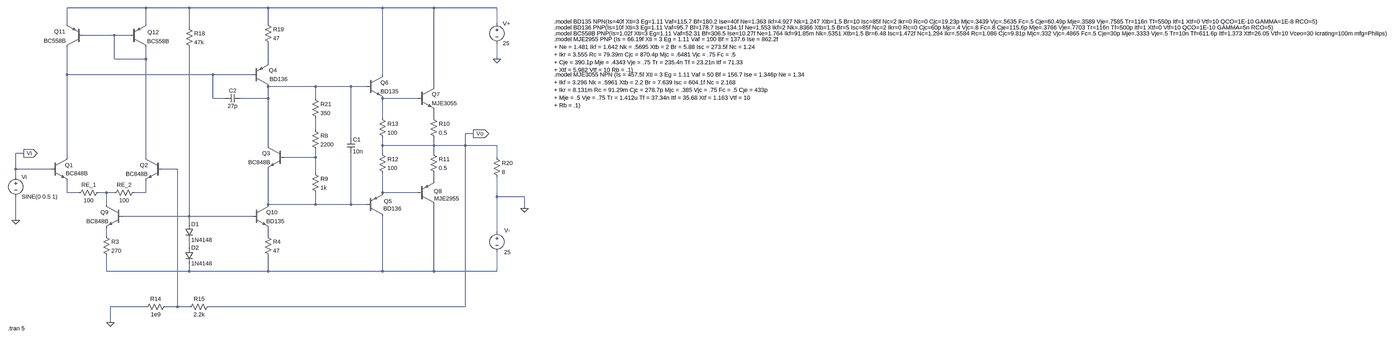
[diagram p0: schematic Ejercicio_6_ganancia_unitaria.asc, whole sheet]
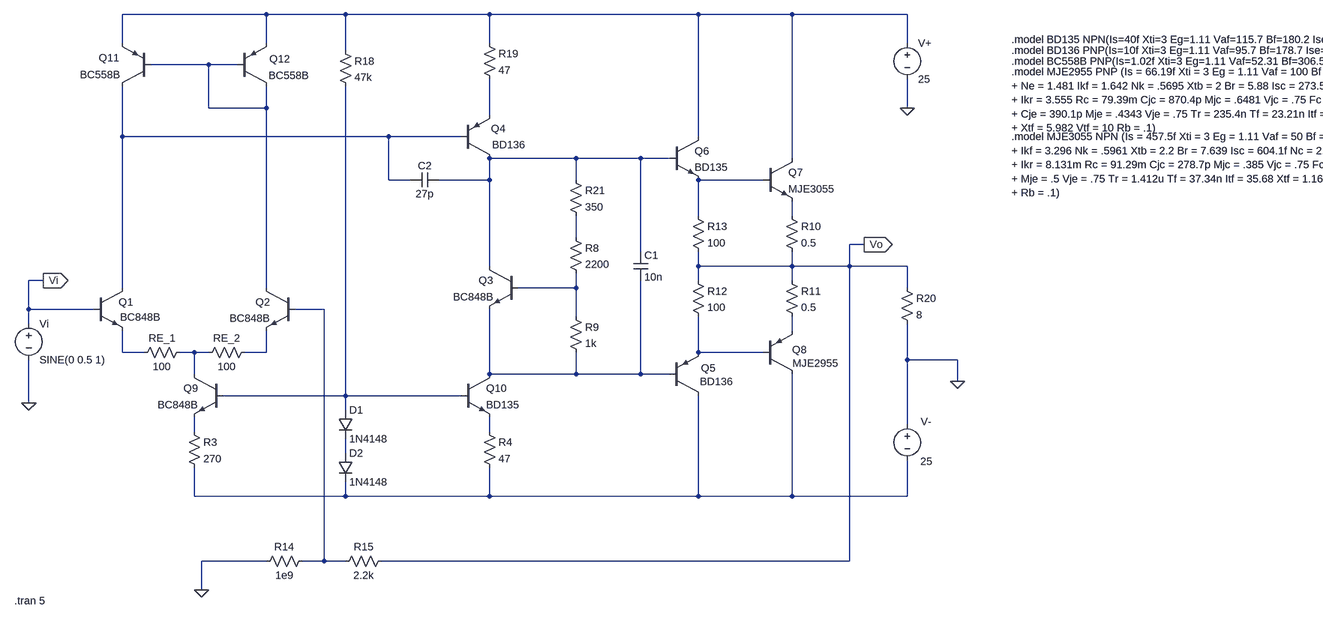
[diagram p1: schematic Ejercicio_6_ganancia_unitaria.asc, part, row 1 of 1, column 1 of 2]
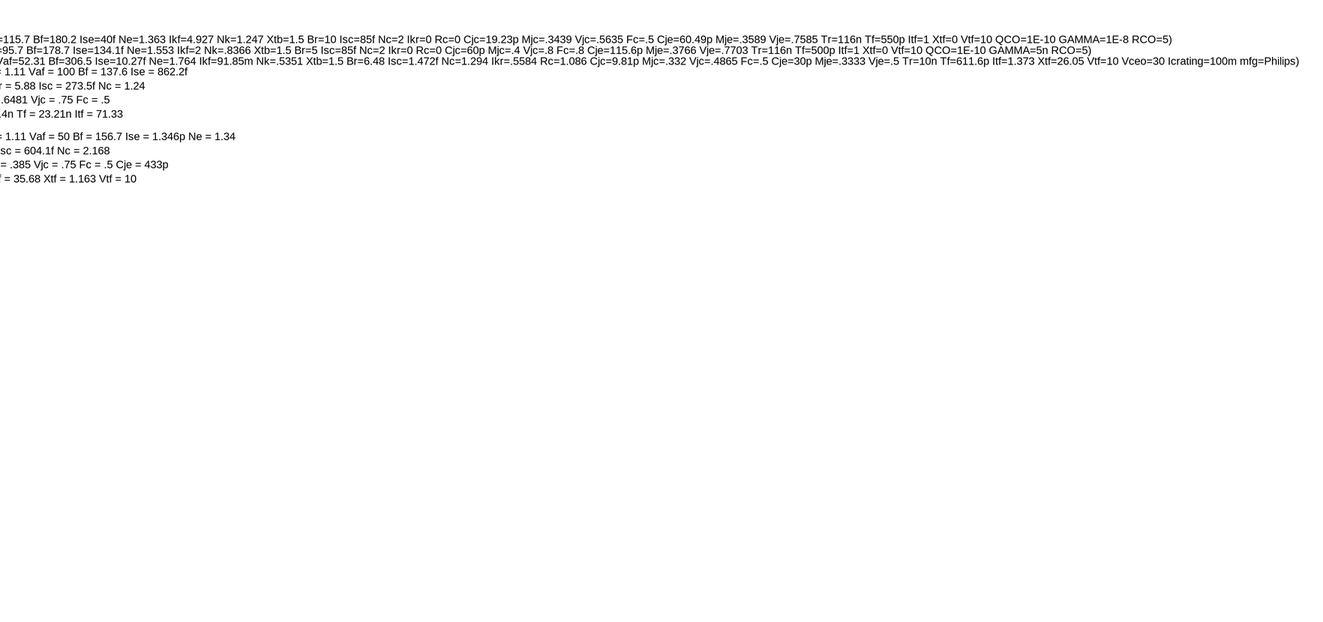
[diagram p2: schematic Ejercicio_6_ganancia_unitaria.asc, part, row 1 of 1, column 2 of 2]
Ejercicio_6_ganancia_unitaria.asc, the LTspice schematic file:
Version 4
SHEET 1 4952 680
WIRE -608 -848 -928 -848
WIRE -432 -848 -608 -848
WIRE -112 -848 -432 -848
WIRE 352 -848 -112 -848
WIRE 560 -848 352 -848
WIRE 816 -848 560 -848
WIRE -928 -784 -928 -848
WIRE -608 -784 -608 -848
WIRE -112 -784 -112 -848
WIRE 816 -784 816 -848
WIRE -432 -768 -432 -848
WIRE -736 -736 -864 -736
WIRE -672 -736 -736 -736
WIRE -736 -640 -736 -736
WIRE -608 -640 -608 -688
WIRE -608 -640 -736 -640
WIRE 816 -640 816 -704
WIRE -112 -624 -112 -704
WIRE -928 -576 -928 -688
WIRE -336 -576 -928 -576
WIRE -176 -576 -336 -576
WIRE 352 -576 352 -848
WIRE 80 -528 -112 -528
WIRE 224 -528 80 -528
WIRE 288 -528 224 -528
WIRE 560 -528 560 -848
WIRE -336 -480 -336 -576
WIRE -288 -480 -336 -480
WIRE -112 -480 -112 -528
WIRE -112 -480 -224 -480
WIRE 80 -480 80 -528
WIRE 496 -480 352 -480
WIRE 352 -400 352 -480
WIRE 560 -400 560 -432
WIRE 80 -352 80 -400
WIRE 720 -336 688 -336
WIRE 224 -320 224 -528
WIRE -112 -288 -112 -480
WIRE 352 -288 352 -320
WIRE 560 -288 560 -320
WIRE 560 -288 352 -288
WIRE 688 -288 688 -336
WIRE 688 -288 560 -288
WIRE 816 -288 688 -288
WIRE -1104 -256 -1136 -256
WIRE 352 -256 352 -288
WIRE 560 -256 560 -288
WIRE -928 -240 -928 -576
WIRE -608 -240 -608 -640
WIRE 80 -240 80 -272
WIRE 80 -240 -48 -240
WIRE 816 -240 816 -288
WIRE -1136 -192 -1136 -256
WIRE -992 -192 -1136 -192
WIRE -480 -192 -544 -192
WIRE 80 -176 80 -240
WIRE -1136 -160 -1136 -192
WIRE 560 -144 560 -176
WIRE -928 -96 -928 -144
WIRE -880 -96 -928 -96
WIRE -768 -96 -800 -96
WIRE -736 -96 -768 -96
WIRE -608 -96 -608 -144
WIRE -608 -96 -656 -96
WIRE 352 -96 352 -176
WIRE 496 -96 352 -96
WIRE 816 -80 816 -160
WIRE 928 -80 816 -80
WIRE -768 -48 -768 -96
WIRE -112 -48 -112 -192
WIRE 80 -48 80 -96
WIRE 80 -48 -112 -48
WIRE 224 -48 224 -256
WIRE 224 -48 80 -48
WIRE 288 -48 224 -48
WIRE 928 -32 928 -80
WIRE -432 0 -432 -688
WIRE -432 0 -704 0
WIRE -176 0 -432 0
WIRE -1136 16 -1136 -80
WIRE -432 32 -432 0
WIRE 816 64 816 -80
WIRE -768 80 -768 48
WIRE -112 80 -112 48
WIRE -432 128 -432 96
WIRE -768 224 -768 160
WIRE -432 224 -432 192
WIRE -432 224 -768 224
WIRE -112 224 -112 160
WIRE -112 224 -432 224
WIRE 352 224 352 0
WIRE 352 224 -112 224
WIRE 560 224 560 -48
WIRE 560 224 352 224
WIRE 816 224 816 144
WIRE 816 224 560 224
WIRE -608 368 -752 368
WIRE -480 368 -480 -192
WIRE -480 368 -528 368
WIRE -432 368 -480 368
WIRE 688 368 688 -288
WIRE 688 368 -352 368
WIRE -752 432 -752 368
FLAG 816 -640 0
FLAG 928 -32 0
FLAG -752 432 0
FLAG -1136 16 0
FLAG 720 -336 Vo
IOPIN 720 -336 Out
FLAG -1104 -256 Vi
IOPIN -1104 -256 Out
SYMBOL pnp -864 -688 R180
WINDOW 0 71 63 Left 2
WINDOW 3 69 26 Left 2
SYMATTR InstName Q11
SYMATTR Value BC558B
SYMBOL pnp -672 -688 M180
WINDOW 0 71 61 Left 2
WINDOW 3 69 24 Left 2
SYMATTR InstName Q12
SYMATTR Value BC558B
SYMBOL npn -992 -240 R0
WINDOW 3 59 65 Left 2
SYMATTR Value BC848B
SYMATTR InstName Q1
SYMBOL npn -544 -240 M0
SYMATTR InstName Q2
SYMATTR Value BC848B
SYMBOL npn -704 -48 M0
SYMATTR InstName Q9
SYMATTR Value BC848B
SYMBOL npn -176 -48 R0
SYMATTR InstName Q10
SYMATTR Value BD135
SYMBOL npn 288 -576 R0
SYMATTR InstName Q6
SYMATTR Value BD135
SYMBOL npn 496 -528 R0
SYMATTR InstName Q7
SYMATTR Value MJE3055
SYMBOL npn -48 -288 M0
SYMATTR InstName Q3
SYMATTR Value BC848B
SYMBOL pnp 496 -48 M180
WINDOW 0 64 54 Left 2
WINDOW 3 65 24 Left 2
SYMATTR InstName Q8
SYMATTR Value MJE2955
SYMBOL pnp 288 0 M180
WINDOW 0 70 61 Left 2
WINDOW 3 67 31 Left 2
SYMATTR InstName Q5
SYMATTR Value BD136
SYMBOL pnp -176 -528 M180
WINDOW 0 67 66 Left 2
WINDOW 3 70 30 Left 2
SYMATTR InstName Q4
SYMATTR Value BD136
SYMBOL voltage 816 -800 R0
WINDOW 123 0 0 Left 0
WINDOW 39 0 0 Left 0
SYMATTR InstName V+
SYMATTR Value 25
SYMBOL voltage 816 48 R0
WINDOW 0 30 10 Left 2
WINDOW 3 29 98 Left 2
WINDOW 123 0 0 Left 0
WINDOW 39 0 0 Left 0
SYMATTR InstName V-
SYMATTR Value 25
SYMBOL res -128 64 R0
SYMATTR InstName R4
SYMATTR Value 47
SYMBOL res -784 64 R0
SYMATTR InstName R3
SYMATTR Value 270
SYMBOL res 64 -496 R0
SYMATTR InstName R21
SYMATTR Value 350
SYMBOL res 64 -368 R0
SYMATTR InstName R8
SYMATTR Value 2200
SYMBOL res 64 -192 R0
SYMATTR InstName R9
SYMATTR Value 1k
SYMBOL res 336 -416 R0
SYMATTR InstName R13
SYMATTR Value 100
SYMBOL res 544 -416 R0
SYMATTR InstName R10
SYMATTR Value 0.5
SYMBOL res 544 -272 R0
SYMATTR InstName R11
SYMATTR Value 0.5
SYMBOL res 336 -272 R0
SYMATTR InstName R12
SYMATTR Value 100
SYMBOL res 800 -256 R0
SYMATTR InstName R20
SYMATTR Value 8
SYMBOL res -128 -800 R0
SYMATTR InstName R19
SYMATTR Value 47
SYMBOL res -784 -112 R90
WINDOW 0 0 56 VBottom 2
WINDOW 3 32 56 VTop 2
SYMATTR InstName RE_1
SYMATTR Value 100
SYMBOL res -640 -112 R90
WINDOW 0 0 56 VBottom 2
WINDOW 3 32 56 VTop 2
SYMATTR InstName RE_2
SYMATTR Value 100
SYMBOL cap 208 -320 R0
SYMATTR InstName C1
SYMATTR Value 10n
SYMBOL cap -224 -496 R90
WINDOW 0 0 32 VBottom 2
WINDOW 3 32 32 VTop 2
SYMATTR InstName C2
SYMATTR Value 27p
SYMBOL res -448 -784 R0
SYMATTR InstName R18
SYMATTR Value 47k
SYMBOL diode -448 32 R0
SYMATTR InstName D1
SYMATTR Value 1N4148
SYMBOL diode -448 128 R0
SYMATTR InstName D2
SYMATTR Value 1N4148
SYMBOL res -512 352 R90
WINDOW 0 0 56 VBottom 2
WINDOW 3 32 56 VTop 2
SYMATTR InstName R14
SYMATTR Value 1e9
SYMBOL res -336 352 R90
WINDOW 0 0 56 VBottom 2
WINDOW 3 32 56 VTop 2
SYMATTR InstName R15
SYMATTR Value 2.2k
SYMBOL voltage -1136 -176 R0
WINDOW 123 0 0 Left 0
WINDOW 39 0 0 Left 0
SYMATTR InstName Vi
SYMATTR Value SINE(0 0.5 1)
TEXT 1176 -744 Left 2 !.model BC558B PNP(Is=1.02f Xti=3 Eg=1.11 Vaf=52.31 Bf=306.5 Ise=10.27f Ne=1.764 Ikf=91.85m Nk=.5351 Xtb=1.5 Br=6.48 Isc=1.472f Nc=1.294 Ikr=.5584 Rc=1.086 Cjc=9.81p Mjc=.332 Vjc=.4865 Fc=.5 Cje=30p Mje=.3333 Vje=.5 Tr=10n Tf=611.6p Itf=1.373 Xtf=26.05 Vtf=10 Vceo=30 Icrating=100m mfg=Philips)
TEXT 1176 -720 Left 2 !.model MJE2955 PNP (Is = 66.19f Xti = 3 Eg = 1.11 Vaf = 100 Bf = 137.6 Ise = 862.2f\n+ Ne = 1.481 Ikf = 1.642 Nk = .5695 Xtb = 2 Br = 5.88 Isc = 273.5f Nc = 1.24\n+ Ikr = 3.555 Rc = 79.39m Cjc = 870.4p Mjc = .6481 Vjc = .75 Fc = .5\n+ Cje = 390.1p Mje = .4343 Vje = .75 Tr = 235.4n Tf = 23.21n Itf = 71.33\n+ Xtf = 5.982 Vtf = 10 Rb = .1)
TEXT 1176 -576 Left 2 !.model MJE3055 NPN (Is = 457.5f Xti = 3 Eg = 1.11 Vaf = 50 Bf = 156.7 Ise = 1.346p Ne = 1.34\n+ Ikf = 3.296 Nk = .5961 Xtb = 2.2 Br = 7.639 Isc = 604.1f Nc = 2.168\n+ Ikr = 8.131m Rc = 91.29m Cjc = 278.7p Mjc = .385 Vjc = .75 Fc = .5 Cje = 433p\n+ Mje = .5 Vje = .75 Tr = 1.412u Tf = 37.34n Itf = 35.68 Xtf = 1.163 Vtf = 10\n+ Rb = .1)
TEXT -1168 456 Left 2 !.tran 5
TEXT 1176 -792 Left 2 !.model BD135 NPN(Is=40f Xti=3 Eg=1.11 Vaf=115.7 Bf=180.2 Ise=40f Ne=1.363 Ikf=4.927 Nk=1.247 Xtb=1.5 Br=10 Isc=85f Nc=2 Ikr=0 Rc=0 Cjc=19.23p Mjc=.3439 Vjc=.5635 Fc=.5 Cje=60.49p Mje=.3589 Vje=.7585 Tr=116n Tf=550p Itf=1 Xtf=0 Vtf=10 QCO=1E-10 GAMMA=1E-8 RCO=5)
TEXT 1176 -768 Left 2 !.model BD136 PNP(Is=10f Xti=3 Eg=1.11 Vaf=95.7 Bf=178.7 Ise=134.1f Ne=1.553 Ikf=2 Nk=.8366 Xtb=1.5 Br=5 Isc=85f Nc=2 Ikr=0 Rc=0 Cjc=60p Mjc=.4 Vjc=.8 Fc=.8 Cje=115.6p Mje=.3766 Vje=.7703 Tr=116n Tf=500p Itf=1 Xtf=0 Vtf=10 QCO=1E-10 GAMMA=5n RCO=5)

The netlist it stands for:
* Ejercicio_6_ganancia_unitaria.asc
Q11 N004 N002 N001 0 BC558B
Q12 N002 N002 N001 0 BC558B
Q1 N004 Vi N012 0 BC848B
Q2 N002 N010 N014 0 BC848B
Q9 N013 N017 N018 0 BC848B
Q10 N016 N017 N019 0 BD135
Q6 N001 N005 N006 0 BD135
Q7 N001 N006 N007 0 MJE3055
Q3 N005 N009 N016 0 BC848B
Q8 N021 N015 N011 0 MJE2955
Q5 N021 N016 N015 0 BD136
Q4 N005 N004 N003 0 BD136
V+ N001 0 25
V- 0 N021 25
R4 N019 N021 47
R3 N018 N021 270
R21 N005 N008 350
R8 N008 N009 2200
R9 N009 N016 1k
R13 N006 Vo 100
R10 N007 Vo 0.5
R11 Vo N011 0.5
R12 Vo N015 100
R20 Vo 0 8
R19 N001 N003 47
RE_1 N013 N012 100
RE_2 N014 N013 100
C1 N005 N016 10n
C2 N005 N004 27p
R18 N001 N017 47k
D1 N017 N020 1N4148
D2 N020 N021 1N4148
R14 N010 0 1e9
R15 Vo N010 2.2k
Vi Vi 0 SINE(0 0.5 1)
.model D D
.lib standard.dio
.model NPN NPN
.model PNP PNP
.lib standard.bjt
.model BC558B PNP(Is=1.02f Xti=3 Eg=1.11 Vaf=52.31 Bf=306.5 Ise=10.27f Ne=1.764 Ikf=91.85m Nk=.5351 Xtb=1.5 Br=6.48 Isc=1.472f Nc=1.294 Ikr=.5584 Rc=1.086 Cjc=9.81p Mjc=.332 Vjc=.4865 Fc=.5 Cje=30p Mje=.3333 Vje=.5 Tr=10n Tf=611.6p Itf=1.373 Xtf=26.05 Vtf=10 Vceo=30 Icrating=100m mfg=Philips)
.model MJE2955 PNP (Is = 66.19f Xti = 3 Eg = 1.11 Vaf = 100 Bf = 137.6 Ise = 862.2f
+ Ne = 1.481 Ikf = 1.642 Nk = .5695 Xtb = 2 Br = 5.88 Isc = 273.5f Nc = 1.24
+ Ikr = 3.555 Rc = 79.39m Cjc = 870.4p Mjc = .6481 Vjc = .75 Fc = .5
+ Cje = 390.1p Mje = .4343 Vje = .75 Tr = 235.4n Tf = 23.21n Itf = 71.33
+ Xtf = 5.982 Vtf = 10 Rb = .1)
.model MJE3055 NPN (Is = 457.5f Xti = 3 Eg = 1.11 Vaf = 50 Bf = 156.7 Ise = 1.346p Ne = 1.34
+ Ikf = 3.296 Nk = .5961 Xtb = 2.2 Br = 7.639 Isc = 604.1f Nc = 2.168
+ Ikr = 8.131m Rc = 91.29m Cjc = 278.7p Mjc = .385 Vjc = .75 Fc = .5 Cje = 433p
+ Mje = .5 Vje = .75 Tr = 1.412u Tf = 37.34n Itf = 35.68 Xtf = 1.163 Vtf = 10
+ Rb = .1)
.tran 5
.model BD135 NPN(Is=40f Xti=3 Eg=1.11 Vaf=115.7 Bf=180.2 Ise=40f Ne=1.363 Ikf=4.927 Nk=1.247 Xtb=1.5 Br=10 Isc=85f Nc=2 Ikr=0 Rc=0 Cjc=19.23p Mjc=.3439 Vjc=.5635 Fc=.5 Cje=60.49p Mje=.3589 Vje=.7585 Tr=116n Tf=550p Itf=1 Xtf=0 Vtf=10 QCO=1E-10 GAMMA=1E-8 RCO=5)
.model BD136 PNP(Is=10f Xti=3 Eg=1.11 Vaf=95.7 Bf=178.7 Ise=134.1f Ne=1.553 Ikf=2 Nk=.8366 Xtb=1.5 Br=5 Isc=85f Nc=2 Ikr=0 Rc=0 Cjc=60p Mjc=.4 Vjc=.8 Fc=.8 Cje=115.6p Mje=.3766 Vje=.7703 Tr=116n Tf=500p Itf=1 Xtf=0 Vtf=10 QCO=1E-10 GAMMA=5n RCO=5)
.backanno
.end